# Altium schematic sheet SATA Ports.schdoc
size 120 x 172 mm
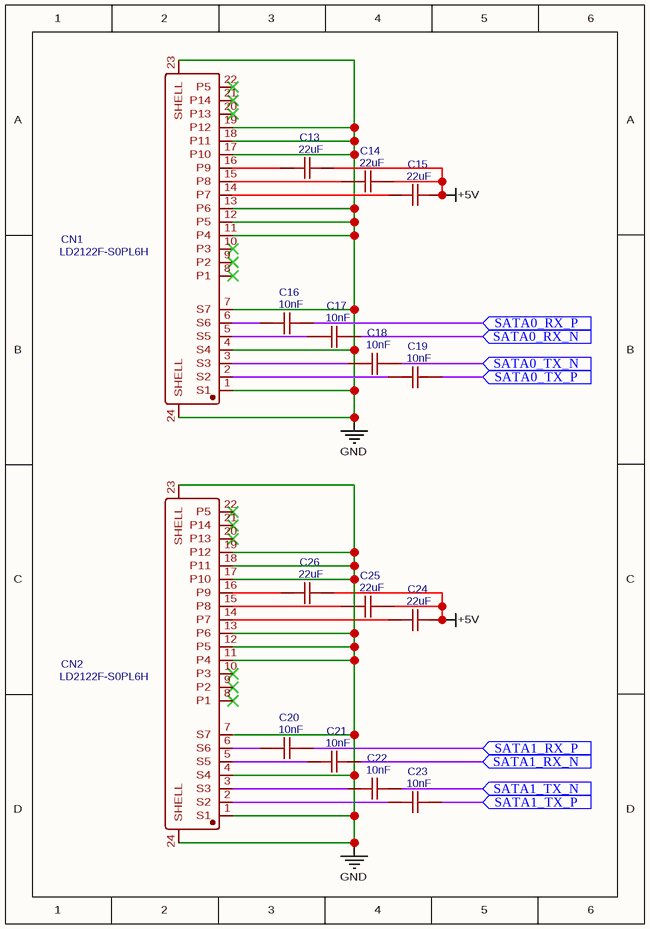
[diagram p0: SATA Ports.schdoc]

## Parts
C13  22uF  [C0603]
C14  22uF  [C0603]
C15  22uF  [C0603]
C16  10nF  [C0402]
C17  10nF  [C0402]
C18  10nF  [C0402]
C19  10nF  [C0402]
C20  10nF  [C0402]
C21  10nF  [C0402]
C22  10nF  [C0402]
C23  10nF  [C0402]
C24  22uF  [C0603]
C25  22uF  [C0603]
C26  22uF  [C0603]
CN1  LD2122F-S0PL6H  [CONN-SMD_LD2122F-S0PL6H]
CN2  LD2122F-S0PL6H  [CONN-SMD_LD2122F-S0PL6H]

## Ports
SATA0_RX_N (in), SATA0_RX_P (in), SATA0_TX_N (in), SATA0_TX_P (in), SATA1_RX_N (in), SATA1_RX_P (in), SATA1_TX_N (in), SATA1_TX_P (in)

## Nets
+5V: C13.2 C14.2 C15.2 C24.2 C25.2 C26.2
GND: CN1.1(S1) CN1.4(S4) CN1.7(S7) CN1.11(P4) CN1.12(P5) CN1.13(P6) CN1.17(P10) CN1.18(P11) CN1.19(P12) CN1.23(SHELL) CN1.24(SHELL) CN2.1(S1) CN2.4(S4) CN2.7(S7) CN2.11(P4) CN2.12(P5) CN2.13(P6) CN2.17(P10) CN2.18(P11) CN2.19(P12) CN2.23(SHELL) CN2.24(SHELL)
SATA0_RX_N: C17.2 ; port SATA0_RX_N
SATA0_RX_P: C16.2 ; port SATA0_RX_P
SATA0_TX_N: C18.2 ; port SATA0_TX_N
SATA0_TX_P: C19.2 ; port SATA0_TX_P
SATA1_RX_N: C21.2 ; port SATA1_RX_N
SATA1_RX_P: C20.2 ; port SATA1_RX_P
SATA1_TX_N: C22.2 ; port SATA1_TX_N
SATA1_TX_P: C23.2 ; port SATA1_TX_P
NetC13_1: C13.1 CN1.16(P9)
NetC14_1: C14.1 CN1.15(P8)
NetC15_1: C15.1 CN1.14(P7)
NetC16_1: C16.1 CN1.6(S6)
NetC17_1: C17.1 CN1.5(S5)
NetC18_1: C18.1 CN1.3(S3)
NetC19_1: C19.1 CN1.2(S2)
NetC20_1: C20.1 CN2.6(S6)
NetC21_1: C21.1 CN2.5(S5)
NetC22_1: C22.1 CN2.3(S3)
NetC23_1: C23.1 CN2.2(S2)
NetC24_1: C24.1 CN2.14(P7)
NetC25_1: C25.1 CN2.15(P8)
NetC26_1: C26.1 CN2.16(P9)

Not connected (* = marked no-connect by the designer): CN1 8(P1)* 9(P2)* 10(P3)* 20(P13)* 21(P14)* 22(P5)*; CN2 8(P1)* 9(P2)* 10(P3)* 20(P13)* 21(P14)* 22(P5)*

## Library data of the parts
C13-C15 C24-C26 = 22uF: Manufacturer: Chinocera(华瓷); Manufacturer Part: HGC0603R5226M160NTHJ; nameAlias: Value; Contributor: lcsc; Supplier: LCSC; Supplier Part: C22367828; JLCPCB Part Class: Extended Part; spicePre: C; spiceSymbolName: HGC0603R5226M160NTHJ
C16-C23 = 10nF: Manufacturer: FOJAN(富捷); Manufacturer Part: FCC0402B103K500AT; nameAlias: Value; Contributor: lcsc; Supplier: LCSC; Supplier Part: C5137480; JLCPCB Part Class: Extended Part; link: https://lcsc.com/eda_search?q=C5137480&%26type=1&ref=editor; spicePre: C; spiceSymbolName: FCC0402B103K500AT
CN1 CN2 = LD2122F-S0PL6H: Manufacturer: FOXCONN(富士康); Contributor: LCSC; Supplier: LCSC; Supplier Part: C2761452; Manufacturer Part: LD2122F-S0PL6H; JLCPCB Part Class: Extended Part; spicePre: C; spiceSymbolName: LD2122F-S0PL6H